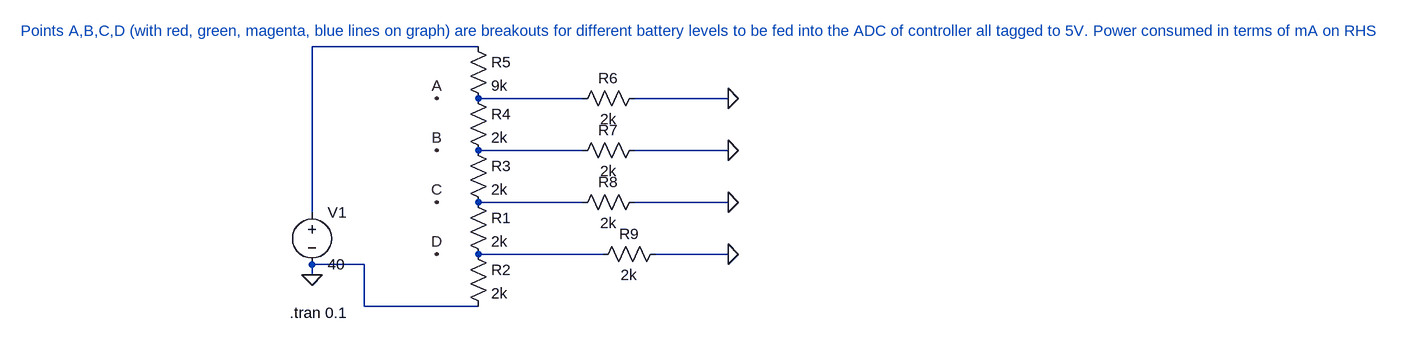
[diagram p0: schematic VoltagedividerSensing.asc]
VoltagedividerSensing.asc, the LTspice schematic file:
Version 4
SHEET 1 2168 680
WIRE 336 -192 80 -192
WIRE 496 -112 336 -112
WIRE 720 -112 576 -112
WIRE 496 -32 336 -32
WIRE 720 -32 576 -32
WIRE 496 48 336 48
WIRE 720 48 576 48
WIRE 80 64 80 -192
WIRE 528 128 336 128
WIRE 720 128 608 128
WIRE 160 144 80 144
WIRE 80 160 80 144
WIRE 160 208 160 144
WIRE 336 208 160 208
FLAG 80 160 0
FLAG 720 -112 0
FLAG 720 -32 0
FLAG 720 48 0
FLAG 720 128 0
FLAG 272 -112 A
FLAG 272 -32 B
FLAG 272 48 C
FLAG 272 128 D
SYMBOL voltage 80 48 R0
WINDOW 123 0 0 Left 2
WINDOW 39 0 0 Left 2
SYMATTR InstName V1
SYMATTR Value 40
SYMBOL res 320 32 R0
SYMATTR InstName R1
SYMATTR Value 2k
SYMBOL res 320 112 R0
SYMATTR InstName R2
SYMATTR Value 2k
SYMBOL res 320 -48 R0
SYMATTR InstName R3
SYMATTR Value 2k
SYMBOL res 320 -128 R0
SYMATTR InstName R4
SYMATTR Value 2k
SYMBOL res 320 -208 R0
SYMATTR InstName R5
SYMATTR Value 9k
SYMBOL res 592 -128 R90
WINDOW 0 0 56 VBottom 2
WINDOW 3 32 56 VTop 2
SYMATTR InstName R6
SYMATTR Value 2k
SYMBOL res 592 -48 R90
WINDOW 0 0 56 VBottom 2
WINDOW 3 32 56 VTop 2
SYMATTR InstName R7
SYMATTR Value 2k
SYMBOL res 592 32 R90
WINDOW 0 0 56 VBottom 2
WINDOW 3 32 56 VTop 2
SYMATTR InstName R8
SYMATTR Value 2k
SYMBOL res 624 112 R90
WINDOW 0 0 56 VBottom 2
WINDOW 3 32 56 VTop 2
SYMATTR InstName R9
SYMATTR Value 2k
TEXT 46 218 Left 2 !.tran 0.1
TEXT -368 -216 Left 2 ;Points A,B,C,D (with red, green, magenta, blue lines on graph) are breakouts for different battery levels to be fed into the ADC of controller all tagged to 5V. Power consumed in terms of mA on RHS

The netlist it stands for:
* VoltagedividerSensing.asc
V1 N001 0 40
R1 N004 N005 2k
R2 N005 0 2k
R3 N003 N004 2k
R4 N002 N003 2k
R5 N001 N002 9k
R6 0 N002 2k
R7 0 N003 2k
R8 0 N004 2k
R9 0 N005 2k
.tran 0.1
* Points A,B,C,D (with red, green, magenta, blue lines on graph) are breakouts for different battery levels to be fed into the ADC of controller all tagged to 5V. Power consumed in terms of mA on RHS
.backanno
.end